# Altium project USB-RS232.PrjPcb
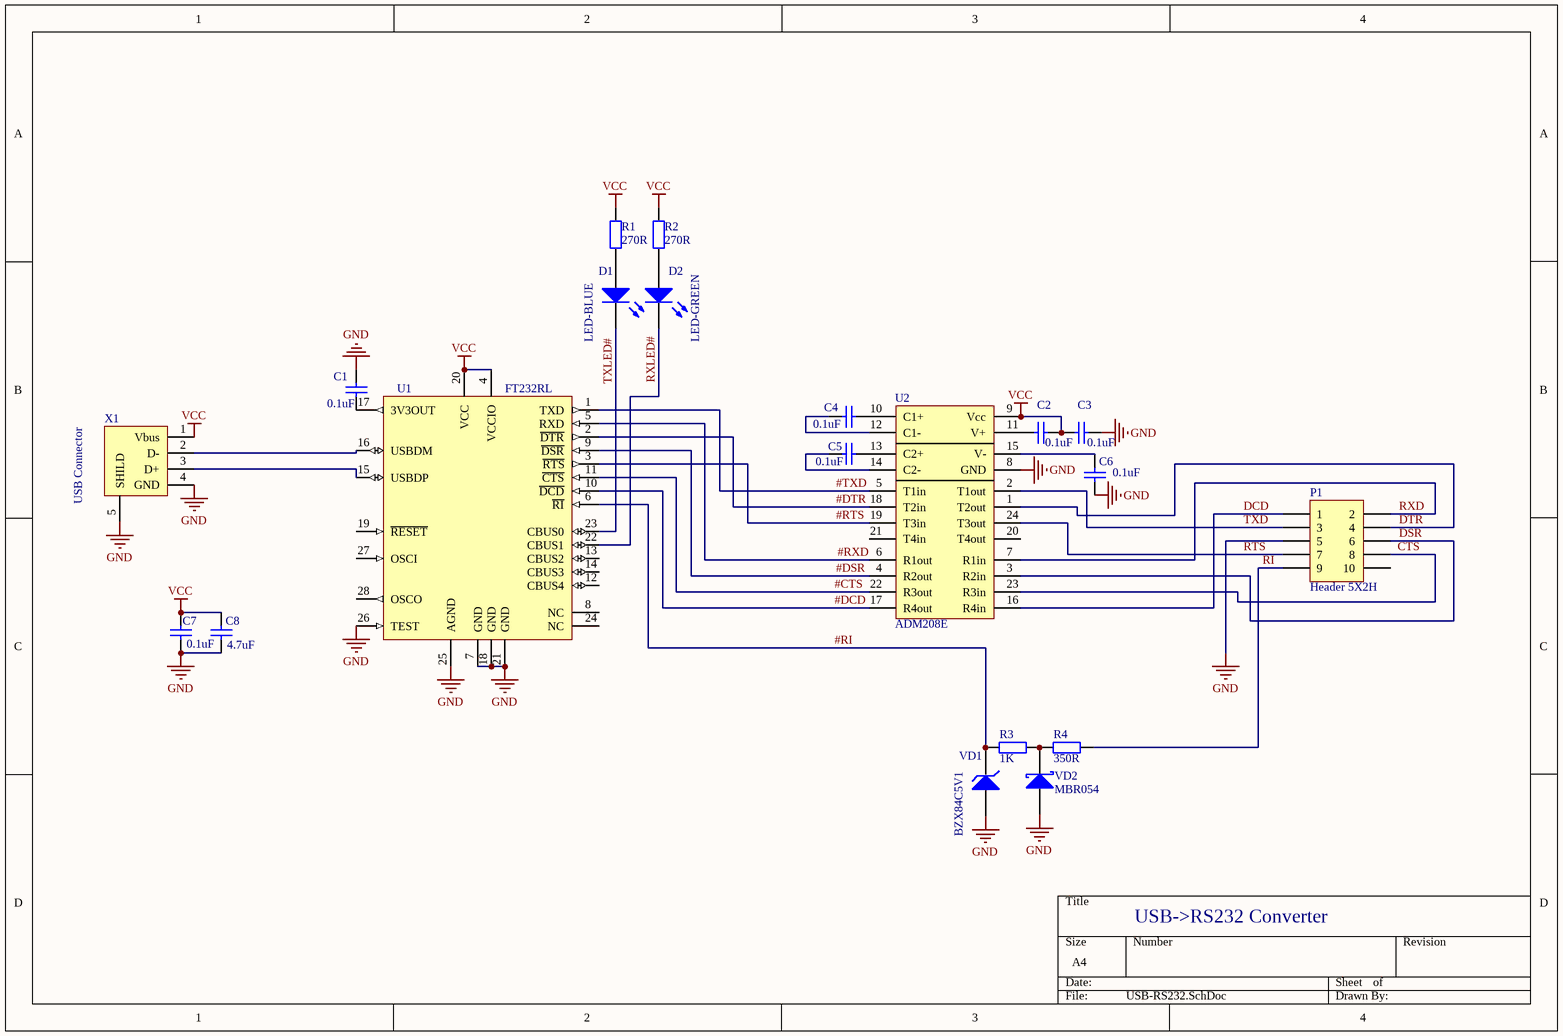
[diagram p0: USB-RS232.SchDoc]
1 sheet, 20 parts. Net scope: global (net labels, ports and power ports of the same name join across sheets).
Board file: USB-RS232.PcbDoc

## Sheet USB-RS232.SchDoc
size A4

### Parts
C1  value 0.1uF  [C0603]  (hidden comment: CAP_SMD)
C2  value 0.1uF  [C0603]  (hidden comment: CAP_SMD)
C3  value 0.1uF  [C0603]  (hidden comment: CAP_SMD)
C4  value 0.1uF  [C0603]  (hidden comment: CAP_SMD)
C5  value 0.1uF  [C0603]  (hidden comment: CAP_SMD)
C6  value 0.1uF  [C0603]  (hidden comment: CAP_SMD)
C7  value 0.1uF  [C0603]  (hidden comment: CAP_SMD)
C8  value 4.7uF  [C0805]  (hidden comment: CAP_SMD)
D1  LED-BLUE  [LED]
D2  LED-GREEN  [LED]
P1  Header 5X2H  [HDR2X5H]
R1  value 270R  [C0603]  (hidden comment: RES_SMD)
R2  value 270R  [C0603]  (hidden comment: RES_SMD)
R3  value 1K  [C0603]  (hidden comment: RES_SMD)
R4  value 350R  [C0603]  (hidden comment: RES_SMD)
U1  FT232RL  [SSOP-28_N]
U2  ADM208E  [SOIC-24]
VD1  BZX84C5V1  [SOT23]
VD2  MBR054  [SOD-123]
X1  USB Connector  [USBB-1J]

### Nets
GND: C1.1 C3.1 C6.2 C7.2 C8.2 P1.5 U1.7(GND) U1.18(GND) U1.21(GND) U1.25(AGND) U1.26(TEST) U2.8(GND) VD1.1(A) VD2.2(A) X1.4(GND) X1.5(SHILD)
VCC: C2.1 C3.2 C7.1 C8.1 R1.2 R2.2 U1.4(VCCIO) U1.20(VCC) U2.9(Vcc) X1.1(Vbus)
#CTS: U1.11(~{CTS}) U2.22(R3out)
#DCD: U1.10(~{DCD}) U2.17(R4out)
#DSR: U1.9(~{DSR}) U2.4(R2out)
#DTR: U1.2(~{DTR}) U2.18(T2in)
#RI: R3.1 U1.6(~{RI}) VD1.3(K)
#RTS: U1.3(~{RTS}) U2.19(T3in)
#RXD: U1.5(RXD) U2.6(R1out)
#TXD: U1.1(TXD) U2.5(T1in)
CTS: P1.8 U2.23(R3in)
DCD: P1.1 U2.16(R4in)
DSR: P1.6 U2.3(R2in)
DTR: P1.4 U2.1(T2out)
RI: P1.9 R4.2
RTS: P1.7 U2.24(T3out)
RXD: P1.2 U2.7(R1in)
RXLED#: D2.2(K) U1.22(CBUS1)
TXD: P1.3 U2.2(T1out)
TXLED#: D1.2(K) U1.23(CBUS0)
NetC1_2: C1.2 U1.17(3V3OUT)
NetC2_2: C2.2 U2.11(V+)
NetC4_1: C4.1 U2.12(C1-)
NetC4_2: C4.2 U2.10(C1+)
NetC5_1: C5.1 U2.14(C2-)
NetC5_2: C5.2 U2.13(C2+)
NetC6_1: C6.1 U2.15(V-)
NetD1_1: D1.1(A) R1.1
NetD2_1: D2.1(A) R2.1
NetR3_2: R3.2 R4.1 VD2.1(K)
NetU1_15: U1.15(USBDP) X1.3(D+)
NetU1_16: U1.16(USBDM) X1.2(D-)

Not connected (* = marked no-connect by the designer): P1 10; U1 8(NC) 12(CBUS4) 13(CBUS2) 14(CBUS3) 19(~{RESET}) 24(NC) 27(OSCI) 28(OSCO); U2 20(T4out) 21(T4in); VD1 2

### Notes on the sheet
- USB->RS232 Converter

### Library data of the parts
C1-C8 = Capasitor_SMD_0805: Capasitor_SMD_0808/
D1 D2 = LED
P1 = Header 5X2H: Header, 5-Pin, Dual row, Right Angle; LatestRevisionDate: 17-Jul-2002; LatestRevisionNote: Re-released for DXP Platform.; Publisher: Altium Limited
R1-R4 = RES: Resistor
U1 = FT232RL-Reel: USB UART Asynchronous Serial Data Transfer Chip, SSOP-28, Tape and Reel; Published: 19-Aug-2010; DatasheetVersion: ver 2.07, Jul-2010; PackageVersion: 2010; PackageReference: SSOP-28; Publisher: Altium Limited; PackageDescription: 28-Pin Small Outline Package 0.65 mm Pitch; ComponentLink1Description: Manufacturer Link; ComponentLink1URL: http://www.ftdichip.com/Products/ICs/FT232R.htm; ComponentLink2Description: Datasheet; ComponentLink2URL: http://www.ftdichip.com/Support/Documents/DataSheets/ICs/DS_FT232R.pdf
VD1 = BZX84C: Value: *